# EAGLE schematic sweet sixteen v24_3 (EAGLE 7.2.0)

## Sheet 1 of 3: Faders / Jacks / Digital
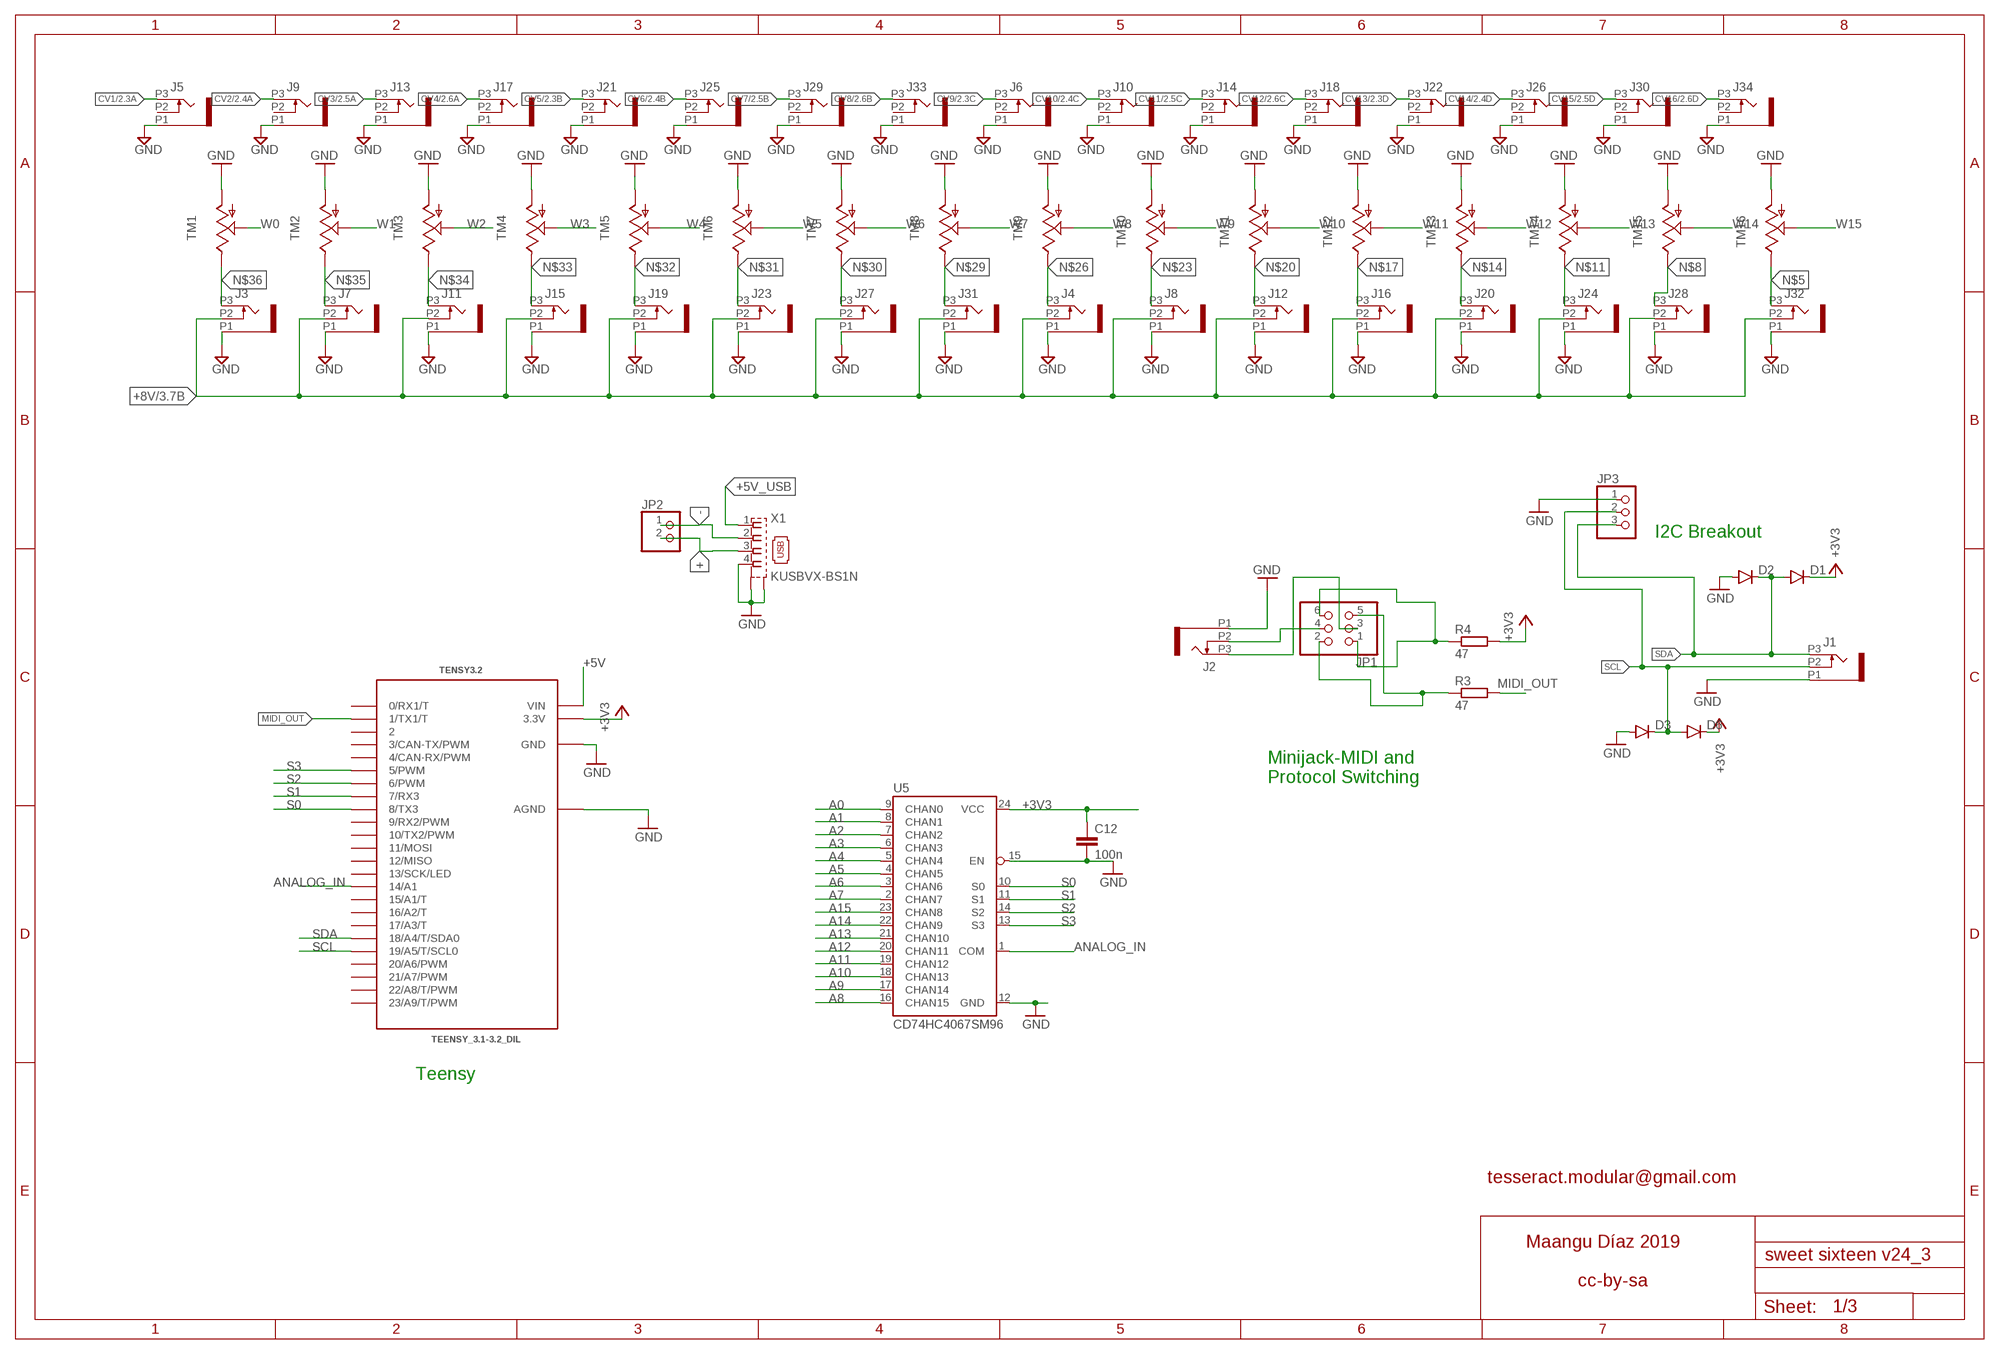
[diagram p0: schematic, sheet 1]

### Parts
C12  100n  C-EUC0603  [C0603]
D1  DIODESOD123  [SOD-123]
D2  DIODESOD123  [SOD-123]
D3  DIODESOD123  [SOD-123]
D6  DIODESOD123  [SOD-123]
J1  PJ301_THONKICONN6  [WQP_PJ_301M6]
J2  PJ301_THONKICONN6  [WQP_PJ_301M6]
J3  PJ301_THONKICONN6  [WQP_PJ_301M6]
J4  PJ301_THONKICONN6  [WQP_PJ_301M6]
J5  PJ301_THONKICONN6  [WQP_PJ_301M6]
J6  PJ301_THONKICONN6  [WQP_PJ_301M6]
J7  PJ301_THONKICONN6  [WQP_PJ_301M6]
J8  PJ301_THONKICONN6  [WQP_PJ_301M6]
J9  PJ301_THONKICONN6  [WQP_PJ_301M6]
J10  PJ301_THONKICONN6  [WQP_PJ_301M6]
J11  PJ301_THONKICONN6  [WQP_PJ_301M6]
J12  PJ301_THONKICONN6  [WQP_PJ_301M6]
J13  PJ301_THONKICONN6  [WQP_PJ_301M6]
J14  PJ301_THONKICONN6  [WQP_PJ_301M6]
J15  PJ301_THONKICONN6  [WQP_PJ_301M6]
J16  PJ301_THONKICONN6  [WQP_PJ_301M6]
J17  PJ301_THONKICONN6  [WQP_PJ_301M6]
J18  PJ301_THONKICONN6  [WQP_PJ_301M6]
J19  PJ301_THONKICONN6  [WQP_PJ_301M6]
J20  PJ301_THONKICONN6  [WQP_PJ_301M6]
J21  PJ301_THONKICONN6  [WQP_PJ_301M6]
J22  PJ301_THONKICONN6  [WQP_PJ_301M6]
J23  PJ301_THONKICONN6  [WQP_PJ_301M6]
J24  PJ301_THONKICONN6  [WQP_PJ_301M6]
J25  PJ301_THONKICONN6  [WQP_PJ_301M6]
J26  PJ301_THONKICONN6  [WQP_PJ_301M6]
J27  PJ301_THONKICONN6  [WQP_PJ_301M6]
J28  PJ301_THONKICONN6  [WQP_PJ_301M6]
J29  PJ301_THONKICONN6  [WQP_PJ_301M6]
J30  PJ301_THONKICONN6  [WQP_PJ_301M6]
J31  PJ301_THONKICONN6  [WQP_PJ_301M6]
J32  PJ301_THONKICONN6  [WQP_PJ_301M6]
J33  PJ301_THONKICONN6  [WQP_PJ_301M6]
J34  PJ301_THONKICONN6  [WQP_PJ_301M6]
JP1  PINHD-2X3  [2X03]
JP2  PINHD-1X2  [1X02]
JP3  PINHD-1X3  [1X03]
R3  47  R-EU_R0805  [R0805]
R4  47  R-EU_R0805  [R0805]
TENSY3.2  TEENSY_3.1-3.2_DIL  [TEENSY_3.0-3.2&LC_DIL]
TM1  TRIMSLIDE45  [SLIDEPOT-45]
TM2  TRIMSLIDE45  [SLIDEPOT-45]
TM3  TRIMSLIDE45  [SLIDEPOT-45]
TM4  TRIMSLIDE45  [SLIDEPOT-45]
TM5  TRIMSLIDE45  [SLIDEPOT-45]
TM6  TRIMSLIDE45  [SLIDEPOT-45]
TM7  TRIMSLIDE45  [SLIDEPOT-45]
TM8  TRIMSLIDE45  [SLIDEPOT-45]
TM9  TRIMSLIDE45  [SLIDEPOT-45]
TM10  TRIMSLIDE45  [SLIDEPOT-45]
TM11  TRIMSLIDE45  [SLIDEPOT-45]
TM12  TRIMSLIDE45  [SLIDEPOT-45]
TM13  TRIMSLIDE45  [SLIDEPOT-45]
TM14  TRIMSLIDE45  [SLIDEPOT-45]
TM15  TRIMSLIDE45  [SLIDEPOT-45]
TM16  TRIMSLIDE45  [SLIDEPOT-45]
U5  CD74HC4067SM96  744067SO24  [SOIC127P1030X265-24]
X1  KUSBVX-BS1N  [KUSBVX-BS1N]

### Nets
+: JP2.2 X1.3
+3V3: C12.1 D1.C D6.C R4.2 TENSY3.2.3.3V U5.24(VCC) ; also sheet 2
+5V: TENSY3.2.VIN ; also sheet 3
+5V_USB: X1.1
+8V: J3.P2 J4.P2 J7.P2 J8.P2 J11.P2 J12.P2 J15.P2 J16.P2 J19.P2 J20.P2 J23.P2 J24.P2 J27.P2 J28.P2 J31.P2 J32.P2 ; also sheet 3
-: JP2.1 X1.2
A0: U5.9(CHAN0) ; also sheet 2
A1: U5.8(CHAN1) ; also sheet 2
A2: U5.7(CHAN2) ; also sheet 2
A3: U5.6(CHAN3) ; also sheet 2
A4: U5.5(CHAN4) ; also sheet 2
A5: U5.4(CHAN5) ; also sheet 2
A6: U5.3(CHAN6) ; also sheet 2
A7: U5.2(CHAN7) ; also sheet 2
A8: U5.16(CHAN15) ; also sheet 2
A9: U5.17(CHAN14) ; also sheet 2
A10: U5.18(CHAN13) ; also sheet 2
A11: U5.19(CHAN12) ; also sheet 2
A12: U5.20(CHAN11) ; also sheet 2
A13: U5.21(CHAN10) ; also sheet 2
A14: U5.22(CHAN9) ; also sheet 2
A15: U5.23(CHAN8) ; also sheet 2
ANALOG_IN: TENSY3.2.14/A0(14/A1) U5.1(COM)
CV1: J5.P3 ; also sheet 2
CV2: J9.P3 ; also sheet 2
CV3: J13.P3 ; also sheet 2
CV4: J17.P3 ; also sheet 2
CV5: J21.P3 ; also sheet 2
CV6: J25.P3 ; also sheet 2
CV7: J29.P3 ; also sheet 2
CV8: J33.P3 ; also sheet 2
CV9: J6.P3 ; also sheet 2
CV10: J10.P3 ; also sheet 2
CV11: J14.P3 ; also sheet 2
CV12: J18.P3 ; also sheet 2
CV13: J22.P3 ; also sheet 2
CV14: J26.P3 ; also sheet 2
CV15: J30.P3 ; also sheet 2
CV16: J34.P3 ; also sheet 2
GND: C12.2 D2.A D3.A J1.P1 J2.P1 J3.P1 J4.P1 J5.P1 J6.P1 J7.P1 J8.P1 J9.P1 J10.P1 J11.P1 J12.P1 J13.P1 J14.P1 J15.P1 J16.P1 J17.P1 J18.P1 J19.P1 J20.P1 J21.P1 J22.P1 J23.P1 J24.P1 J25.P1 J26.P1 J27.P1 J28.P1 J29.P1 J30.P1 J31.P1 J32.P1 J33.P1 J34.P1 JP3.1 TENSY3.2.AGND TENSY3.2.GND TM1.A TM2.A TM3.A TM4.A TM5.A TM6.A TM7.A TM8.A TM9.A TM10.A TM11.A TM12.A TM13.A TM14.A TM15.A TM16.A U5.12(GND) U5.15(EN) X1.4 X1.M1(S1) X1.M2(S2) ; also sheet 2,3
MIDI_OUT: R3.2 TENSY3.2.1(1/TX1/T)
N$1: J2.P3 JP1.3
N$2: J2.P2 JP1.4
N$3: JP1.2 JP1.5 R3.1
N$4: JP1.1 JP1.6 R4.1
N$5: J32.P3 TM16.B
N$8: J28.P3 TM15.B
N$11: J24.P3 TM14.B
N$14: J20.P3 TM13.B
N$17: J16.P3 TM12.B
N$20: J12.P3 TM11.B
N$23: J8.P3 TM10.B
N$26: J4.P3 TM9.B
N$29: J31.P3 TM8.B
N$30: J27.P3 TM7.B
N$31: J23.P3 TM6.B
N$32: J19.P3 TM5.B
N$33: J15.P3 TM4.B
N$34: J11.P3 TM3.B
N$35: J7.P3 TM2.B
N$36: J3.P3 TM1.B
S0: TENSY3.2.8(8/TX3) U5.10(S0)
S1: TENSY3.2.7(7/RX3) U5.11(S1)
S2: TENSY3.2.6(6/PWM) U5.14(S2)
S3: TENSY3.2.5(5/PWM) U5.13(S3)
SCL: D3.C D6.A J1.P2 JP3.2 TENSY3.2.19/A5(19/A5/T/SCL0)
SDA: D1.A D2.C J1.P3 JP3.3 TENSY3.2.18/A4(18/A4/T/SDA0)
W0: TM1.WIPER ; also sheet 2
W1: TM2.WIPER ; also sheet 2
W2: TM3.WIPER ; also sheet 2
W3: TM4.WIPER ; also sheet 2
W4: TM5.WIPER ; also sheet 2
W5: TM6.WIPER ; also sheet 2
W6: TM7.WIPER ; also sheet 2
W7: TM8.WIPER ; also sheet 2
W8: TM9.WIPER ; also sheet 2
W9: TM10.WIPER ; also sheet 2
W10: TM11.WIPER ; also sheet 2
W11: TM12.WIPER ; also sheet 2
W12: TM13.WIPER ; also sheet 2
W13: TM14.WIPER ; also sheet 2
W14: TM15.WIPER ; also sheet 2
W15: TM16.WIPER ; also sheet 2
Unconnected: J5.P2 J6.P2 J9.P2 J10.P2 J13.P2 J14.P2 J17.P2 J18.P2 J21.P2 J22.P2 J25.P2 J26.P2 J29.P2 J30.P2 J33.P2 J34.P2 TENSY3.2.0(0/RX1/T) TENSY3.2.2 TENSY3.2.3(3/CAN-TX/PWM) TENSY3.2.4(4/CAN-RX/PWM) TENSY3.2.9(9/RX2/PWM) TENSY3.2.10(10/TX2/PWM) TENSY3.2.11(11/MOSI) TENSY3.2.12(12/MISO) TENSY3.2.13(13/SCK/LED) TENSY3.2.15/A1(15/A1/T) TENSY3.2.16/A2(16/A2/T) TENSY3.2.17/A3(17/A3/T) TENSY3.2.20/A6(20/A6/PWM) TENSY3.2.21/A7(21/A7/PWM) TENSY3.2.22/A8(22/A8/T/PWM) TENSY3.2.23/A9(23/A9/T/PWM)

### Notes on the sheet
- I2C Breakout
- Minijack-MIDI and 
  Protocol Switching
- Teensy
- tesseract.modular@gmail.com
- Maangu Díaz 2019
- cc-by-sa

## Sheet 2 of 3: Buffers / OpAmp power
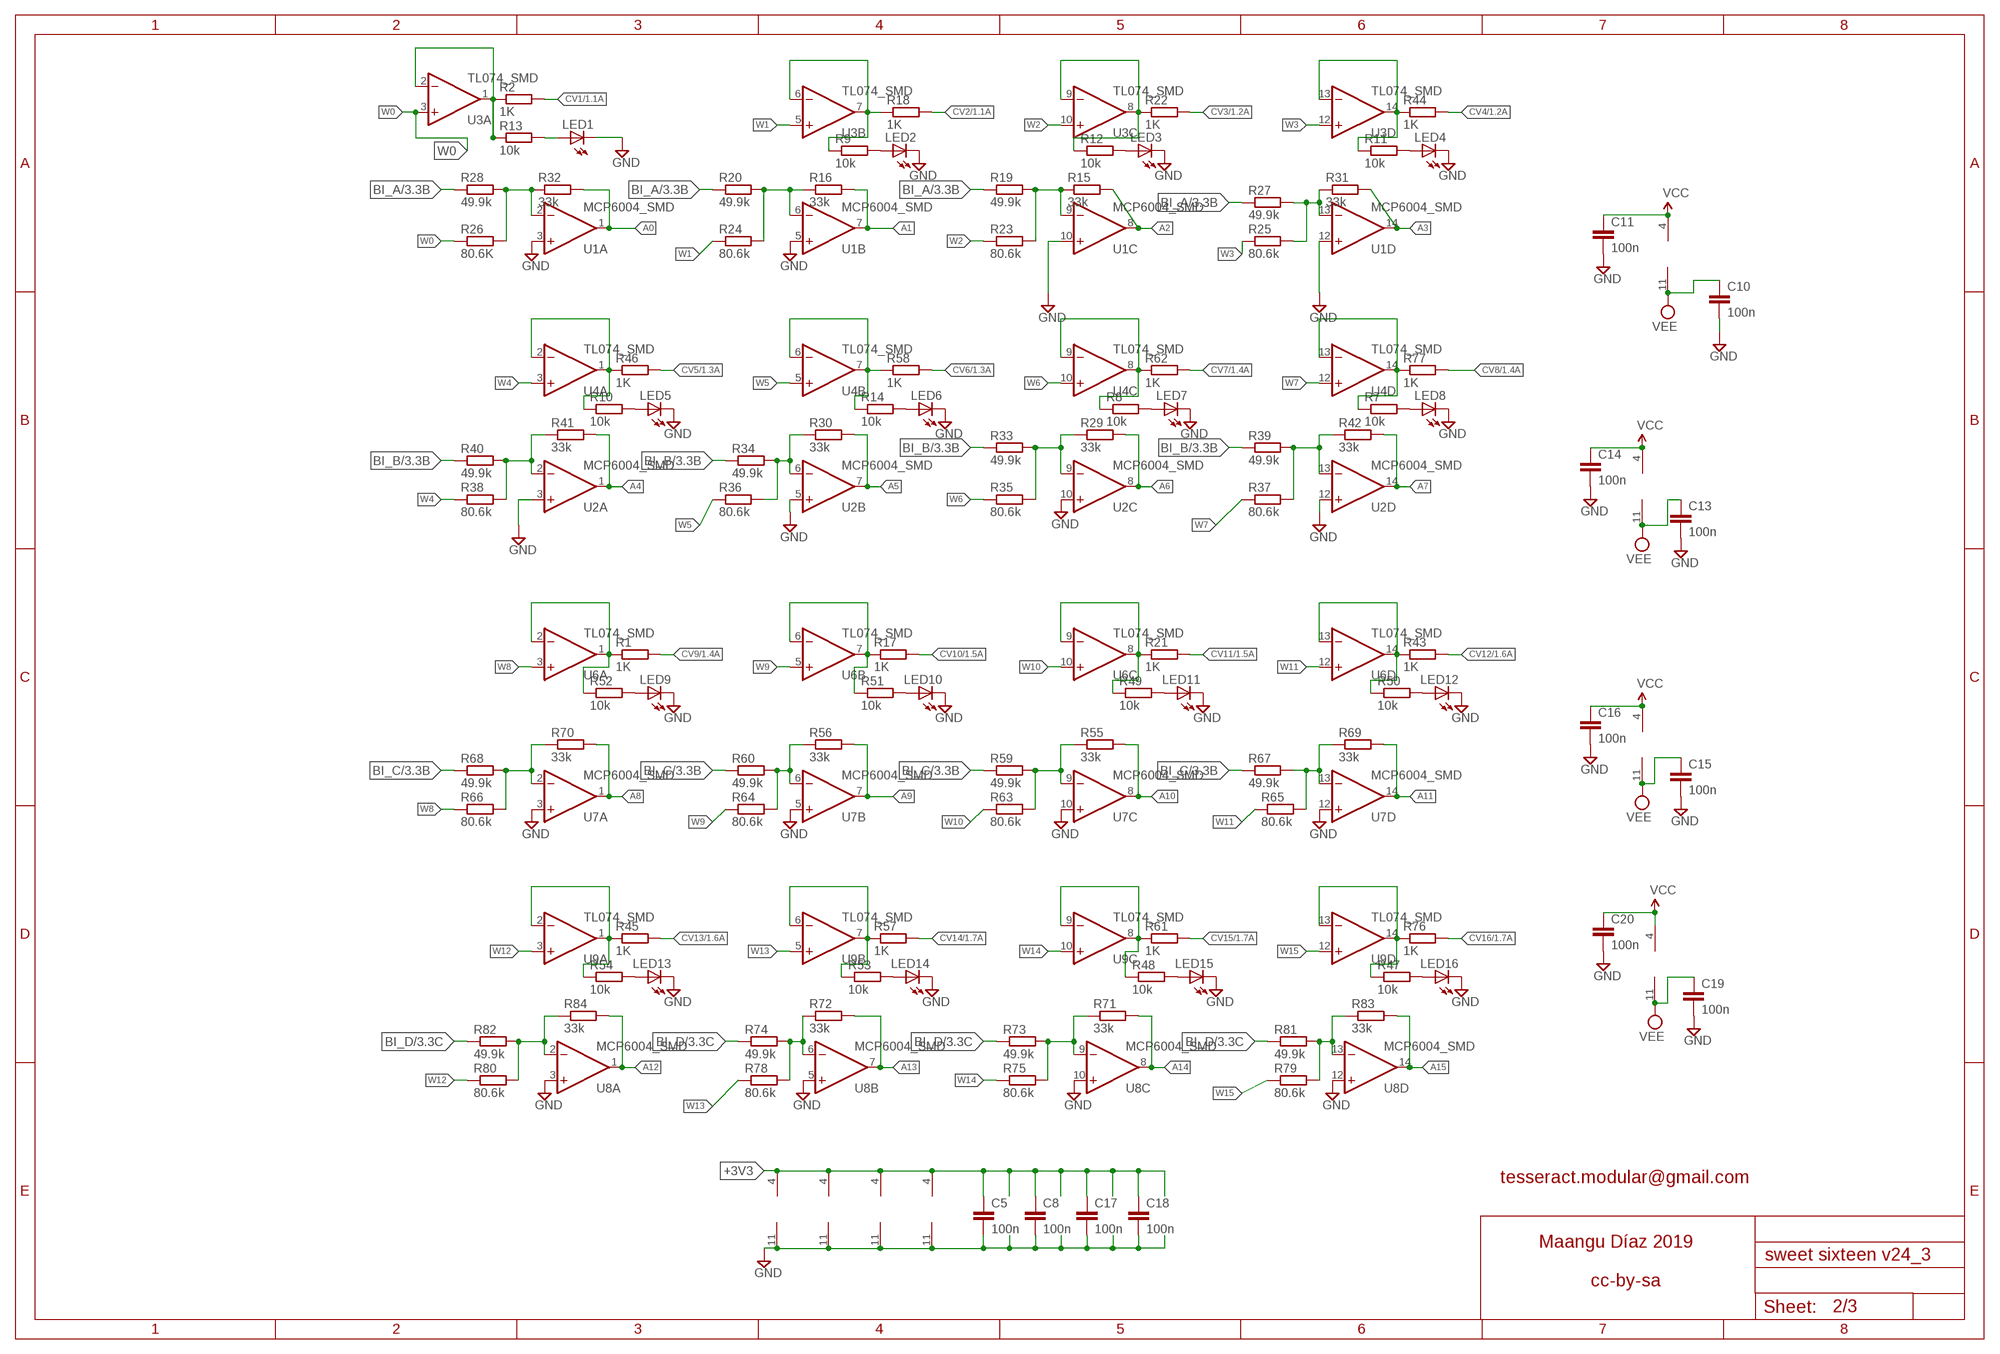
[diagram p1: schematic, sheet 2]

### Parts
C5  100n  C-EUC0603  [C0603]
C8  100n  C-EUC0603K  [C0603K]
C10  100n  C-EUC0603  [C0603]
C11  100n  C-EUC0603  [C0603]
C13  100n  C-EUC0603  [C0603]
C14  100n  C-EUC0603  [C0603]
C15  100n  C-EUC0603  [C0603]
C16  100n  C-EUC0603  [C0603]
C17  100n  C-EUC0603K  [C0603K]
C18  100n  C-EUC0603  [C0603]
C19  100n  C-EUC0603  [C0603]
C20  100n  C-EUC0603  [C0603]
LED1  LED3MM  [LED3MM]
LED2  LED3MM  [LED3MM]
LED3  LED3MM  [LED3MM]
LED4  LED3MM  [LED3MM]
LED5  LED3MM  [LED3MM]
LED6  LED3MM  [LED3MM]
LED7  LED3MM  [LED3MM]
LED8  LED3MM  [LED3MM]
LED9  LED3MM  [LED3MM]
LED10  LED3MM  [LED3MM]
LED11  LED3MM  [LED3MM]
LED12  LED3MM  [LED3MM]
LED13  LED3MM  [LED3MM]
LED14  LED3MM  [LED3MM]
LED15  LED3MM  [LED3MM]
LED16  LED3MM  [LED3MM]
R1  1K  R-EU_R0603  [R0603]
R2  1K  R-EU_R0603  [R0603]
R7  10k  R-EU_R0603  [R0603]
R8  10k  R-EU_R0603  [R0603]
R9  10k  R-EU_R0603  [R0603]
R10  10k  R-EU_R0603  [R0603]
R11  10k  R-EU_R0603  [R0603]
R12  10k  R-EU_R0603  [R0603]
R13  10k  R-EU_R0603  [R0603]
R14  10k  R-EU_R0603  [R0603]
R15  33k  R-EU_R0603  [R0603]
R16  33k  R-EU_R0603  [R0603]
R17  1K  R-EU_R0603  [R0603]
R18  1K  R-EU_R0603  [R0603]
R19  49.9k  R-EU_R0603  [R0603]
R20  49.9k  R-EU_R0603  [R0603]
R21  1K  R-EU_R0603  [R0603]
R22  1K  R-EU_R0603  [R0603]
R23  80.6k  R-EU_R0603  [R0603]
R24  80.6k  R-EU_R0603  [R0603]
R25  80.6k  R-EU_R0603  [R0603]
R26  80.6K  R-EU_R0603  [R0603]
R27  49.9k  R-EU_R0603  [R0603]
R28  49.9k  R-EU_R0603  [R0603]
R29  33k  R-EU_R0603  [R0603]
R30  33k  R-EU_R0603  [R0603]
R31  33k  R-EU_R0603  [R0603]
R32  33k  R-EU_R0603  [R0603]
R33  49.9k  R-EU_R0603  [R0603]
R34  49.9k  R-EU_R0603  [R0603]
R35  80.6k  R-EU_R0603  [R0603]
R36  80.6k  R-EU_R0603  [R0603]
R37  80.6k  R-EU_R0603  [R0603]
R38  80.6k  R-EU_R0603  [R0603]
R39  49.9k  R-EU_R0603  [R0603]
R40  49.9k  R-EU_R0603  [R0603]
R41  33k  R-EU_R0603  [R0603]
R42  33k  R-EU_R0603  [R0603]
R43  1K  R-EU_R0603  [R0603]
R44  1K  R-EU_R0603  [R0603]
R45  1K  R-EU_R0603  [R0603]
R46  1K  R-EU_R0603  [R0603]
R47  10k  R-EU_R0603  [R0603]
R48  10k  R-EU_R0603  [R0603]
R49  10k  R-EU_R0603  [R0603]
R50  10k  R-EU_R0603  [R0603]
R51  10k  R-EU_R0603  [R0603]
R52  10k  R-EU_R0603  [R0603]
R53  10k  R-EU_R0603  [R0603]
R54  10k  R-EU_R0603  [R0603]
R55  33k  R-EU_R0603  [R0603]
R56  33k  R-EU_R0603  [R0603]
R57  1K  R-EU_R0603  [R0603]
R58  1K  R-EU_R0603  [R0603]
R59  49.9k  R-EU_R0603  [R0603]
R60  49.9k  R-EU_R0603  [R0603]
R61  1K  R-EU_R0603  [R0603]
R62  1K  R-EU_R0603  [R0603]
R63  80.6k  R-EU_R0603  [R0603]
R64  80.6k  R-EU_R0603  [R0603]
R65  80.6k  R-EU_R0603  [R0603]
R66  80.6k  R-EU_R0603  [R0603]
R67  49.9k  R-EU_R0603  [R0603]
R68  49.9k  R-EU_R0603  [R0603]
R69  33k  R-EU_R0603  [R0603]
R70  33k  R-EU_R0603  [R0603]
R71  33k  R-EU_R0603  [R0603]
R72  33k  R-EU_R0603  [R0603]
R73  49.9k  R-EU_R0603  [R0603]
R74  49.9k  R-EU_R0603  [R0603]
R75  80.6k  R-EU_R0603  [R0603]
R76  1K  R-EU_R0603  [R0603]
R77  1K  R-EU_R0603  [R0603]
R78  80.6k  R-EU_R0603  [R0603]
R79  80.6k  R-EU_R0603  [R0603]
R80  80.6k  R-EU_R0603  [R0603]
R81  49.9k  R-EU_R0603  [R0603]
R82  49.9k  R-EU_R0603  [R0603]
R83  33k  R-EU_R0603  [R0603]
R84  33k  R-EU_R0603  [R0603]
U1  MCP6004_SMD  [SO14]
U2  MCP6004_SMD  [SO14]
U3  TL074_SMD  [SO14]
U4  TL074_SMD  [SO14]
U6  TL074_SMD  [SO14]
U7  MCP6004_SMD  [SO14]
U8  MCP6004_SMD  [SO14]
U9  TL074_SMD  [SO14]

### Nets
+3V3: C5.1 C8.1 C17.1 C18.1 U1.4(P:V+) U2.4(P:V+) U7.4(P:V+) U8.4(P:V+) ; also sheet 1
A0: R32.2 U1.1(A:OUT) ; also sheet 1
A1: R16.2 U1.7(B:OUT) ; also sheet 1
A2: R15.2 U1.8(C:OUT) ; also sheet 1
A3: R31.2 U1.14(D:OUT) ; also sheet 1
A4: R41.2 U2.1(A:OUT) ; also sheet 1
A5: R30.2 U2.7(B:OUT) ; also sheet 1
A6: R29.2 U2.8(C:OUT) ; also sheet 1
A7: R42.2 U2.14(D:OUT) ; also sheet 1
A8: R70.2 U7.1(A:OUT) ; also sheet 1
A9: R56.2 U7.7(B:OUT) ; also sheet 1
A10: R55.2 U7.8(C:OUT) ; also sheet 1
A11: R69.2 U7.14(D:OUT) ; also sheet 1
A12: R84.2 U8.1(A:OUT) ; also sheet 1
A13: R72.2 U8.7(B:OUT) ; also sheet 1
A14: R71.2 U8.8(C:OUT) ; also sheet 1
A15: R83.2 U8.14(D:OUT) ; also sheet 1
BI_A: R19.1 R20.1 R27.1 R28.1 ; also sheet 3
BI_B: R33.1 R34.1 R39.1 R40.1 ; also sheet 3
BI_C: R59.1 R60.1 R67.1 R68.1 ; also sheet 3
BI_D: R73.1 R74.1 R81.1 R82.1 ; also sheet 3
CV1: R2.2 ; also sheet 1
CV2: R18.2 ; also sheet 1
CV3: R22.2 ; also sheet 1
CV4: R44.2 ; also sheet 1
CV5: R46.2 ; also sheet 1
CV6: R58.2 ; also sheet 1
CV7: R62.2 ; also sheet 1
CV8: R77.2 ; also sheet 1
CV9: R1.2 ; also sheet 1
CV10: R17.2 ; also sheet 1
CV11: R21.2 ; also sheet 1
CV12: R43.2 ; also sheet 1
CV13: R45.2 ; also sheet 1
CV14: R57.2 ; also sheet 1
CV15: R61.2 ; also sheet 1
CV16: R76.2 ; also sheet 1
GND: C5.2 C8.2 C10.2 C11.2 C13.2 C14.2 C15.2 C16.2 C17.2 C18.2 C19.2 C20.2 LED1.K(C) LED2.K(C) LED3.K(C) LED4.K(C) LED5.K(C) LED6.K(C) LED7.K(C) LED8.K(C) LED9.K(C) LED10.K(C) LED11.K(C) LED12.K(C) LED13.K(C) LED14.K(C) LED15.K(C) LED16.K(C) U1.3(A:+IN) U1.5(B:+IN) U1.10(C:+IN) U1.11(P:V-) U1.12(D:+IN) U2.3(A:+IN) U2.5(B:+IN) U2.10(C:+IN) U2.11(P:V-) U2.12(D:+IN) U7.3(A:+IN) U7.5(B:+IN) U7.10(C:+IN) U7.11(P:V-) U7.12(D:+IN) U8.3(A:+IN) U8.5(B:+IN) U8.10(C:+IN) U8.11(P:V-) U8.12(D:+IN) ; also sheet 1,3
N$6: R15.1 R19.2 R23.2 U1.9(C:-IN)
N$7: R25.2 R27.2 R31.1 U1.13(D:-IN)
N$9: R26.2 R28.2 R32.1 U1.2(A:-IN)
N$10: R16.1 R20.2 R24.2 U1.6(B:-IN)
N$12: R38.2 R40.2 R41.1 U2.2(A:-IN)
N$13: R30.1 R34.2 R36.2 U2.6(B:-IN)
N$15: R29.1 R33.2 R35.2 U2.9(C:-IN)
N$16: R37.2 R39.2 R42.1 U2.13(D:-IN)
N$18: R80.2 R82.2 R84.1 U8.2(A:-IN)
N$19: LED1.A R13.2
N$21: R71.1 R73.2 R75.2 U8.9(C:-IN)
N$22: R79.2 R81.2 R83.1 U8.13(D:-IN)
N$24: R66.2 R68.2 R70.1 U7.2(A:-IN)
N$25: LED2.A R9.2
N$27: R56.1 R60.2 R64.2 U7.6(B:-IN)
N$28: R55.1 R59.2 R63.2 U7.9(C:-IN)
N$37: R65.2 R67.2 R69.1 U7.13(D:-IN)
N$38: LED3.A R12.2
N$39: LED4.A R11.2
N$40: LED8.A R7.2
N$42: LED7.A R8.2
N$43: LED6.A R14.2
N$44: LED5.A R10.2
N$45: LED9.A R52.2
N$46: LED10.A R51.2
N$47: LED11.A R49.2
N$48: LED12.A R50.2
N$49: LED13.A R54.2
N$50: LED14.A R53.2
N$51: LED15.A R48.2
N$52: R72.1 R74.2 R78.2 U8.6(B:-IN)
N$53: LED16.A R47.2
N$300: R2.1 R13.1 U3.1(A:OUT) U3.2(A:-IN)
N$301: R9.1 R18.1 U3.6(B:-IN) U3.7(B:OUT)
N$302: R12.1 R22.1 U3.8(C:OUT) U3.9(C:-IN)
N$303: R11.1 R44.1 U3.13(D:-IN) U3.14(D:OUT)
N$304: R10.1 R46.1 U4.1(A:OUT) U4.2(A:-IN)
N$305: R14.1 R58.1 U4.6(B:-IN) U4.7(B:OUT)
N$306: R8.1 R62.1 U4.8(C:OUT) U4.9(C:-IN)
N$307: R7.1 R77.1 U4.13(D:-IN) U4.14(D:OUT)
N$308: R1.1 R52.1 U6.1(A:OUT) U6.2(A:-IN)
N$309: R17.1 R51.1 U6.6(B:-IN) U6.7(B:OUT)
N$310: R21.1 R49.1 U6.8(C:OUT) U6.9(C:-IN)
N$311: R43.1 R50.1 U6.13(D:-IN) U6.14(D:OUT)
N$312: R45.1 R54.1 U9.1(A:OUT) U9.2(A:-IN)
N$313: R53.1 R57.1 U9.6(B:-IN) U9.7(B:OUT)
N$314: R48.1 R61.1 U9.8(C:OUT) U9.9(C:-IN)
N$315: R47.1 R76.1 U9.13(D:-IN) U9.14(D:OUT)
VCC: C11.1 C14.1 C16.1 C20.1 U3.4(P:V+) U4.4(P:V+) U6.4(P:V+) U9.4(P:V+) ; also sheet 3
VEE: C10.1 C13.1 C15.1 C19.1 U3.11(P:V-) U4.11(P:V-) U6.11(P:V-) U9.11(P:V-) ; also sheet 3
W0: R26.1 U3.3(A:+IN) ; also sheet 1
W1: R24.1 U3.5(B:+IN) ; also sheet 1
W2: R23.1 U3.10(C:+IN) ; also sheet 1
W3: R25.1 U3.12(D:+IN) ; also sheet 1
W4: R38.1 U4.3(A:+IN) ; also sheet 1
W5: R36.1 U4.5(B:+IN) ; also sheet 1
W6: R35.1 U4.10(C:+IN) ; also sheet 1
W7: R37.1 U4.12(D:+IN) ; also sheet 1
W8: R66.1 U6.3(A:+IN) ; also sheet 1
W9: R64.1 U6.5(B:+IN) ; also sheet 1
W10: R63.1 U6.10(C:+IN) ; also sheet 1
W11: R65.1 U6.12(D:+IN) ; also sheet 1
W12: R80.1 U9.3(A:+IN) ; also sheet 1
W13: R78.1 U9.5(B:+IN) ; also sheet 1
W14: R75.1 U9.10(C:+IN) ; also sheet 1
W15: R79.1 U9.12(D:+IN) ; also sheet 1

### Notes on the sheet
- tesseract.modular@gmail.com
- Maangu Díaz 2019
- cc-by-sa

## Sheet 3 of 3
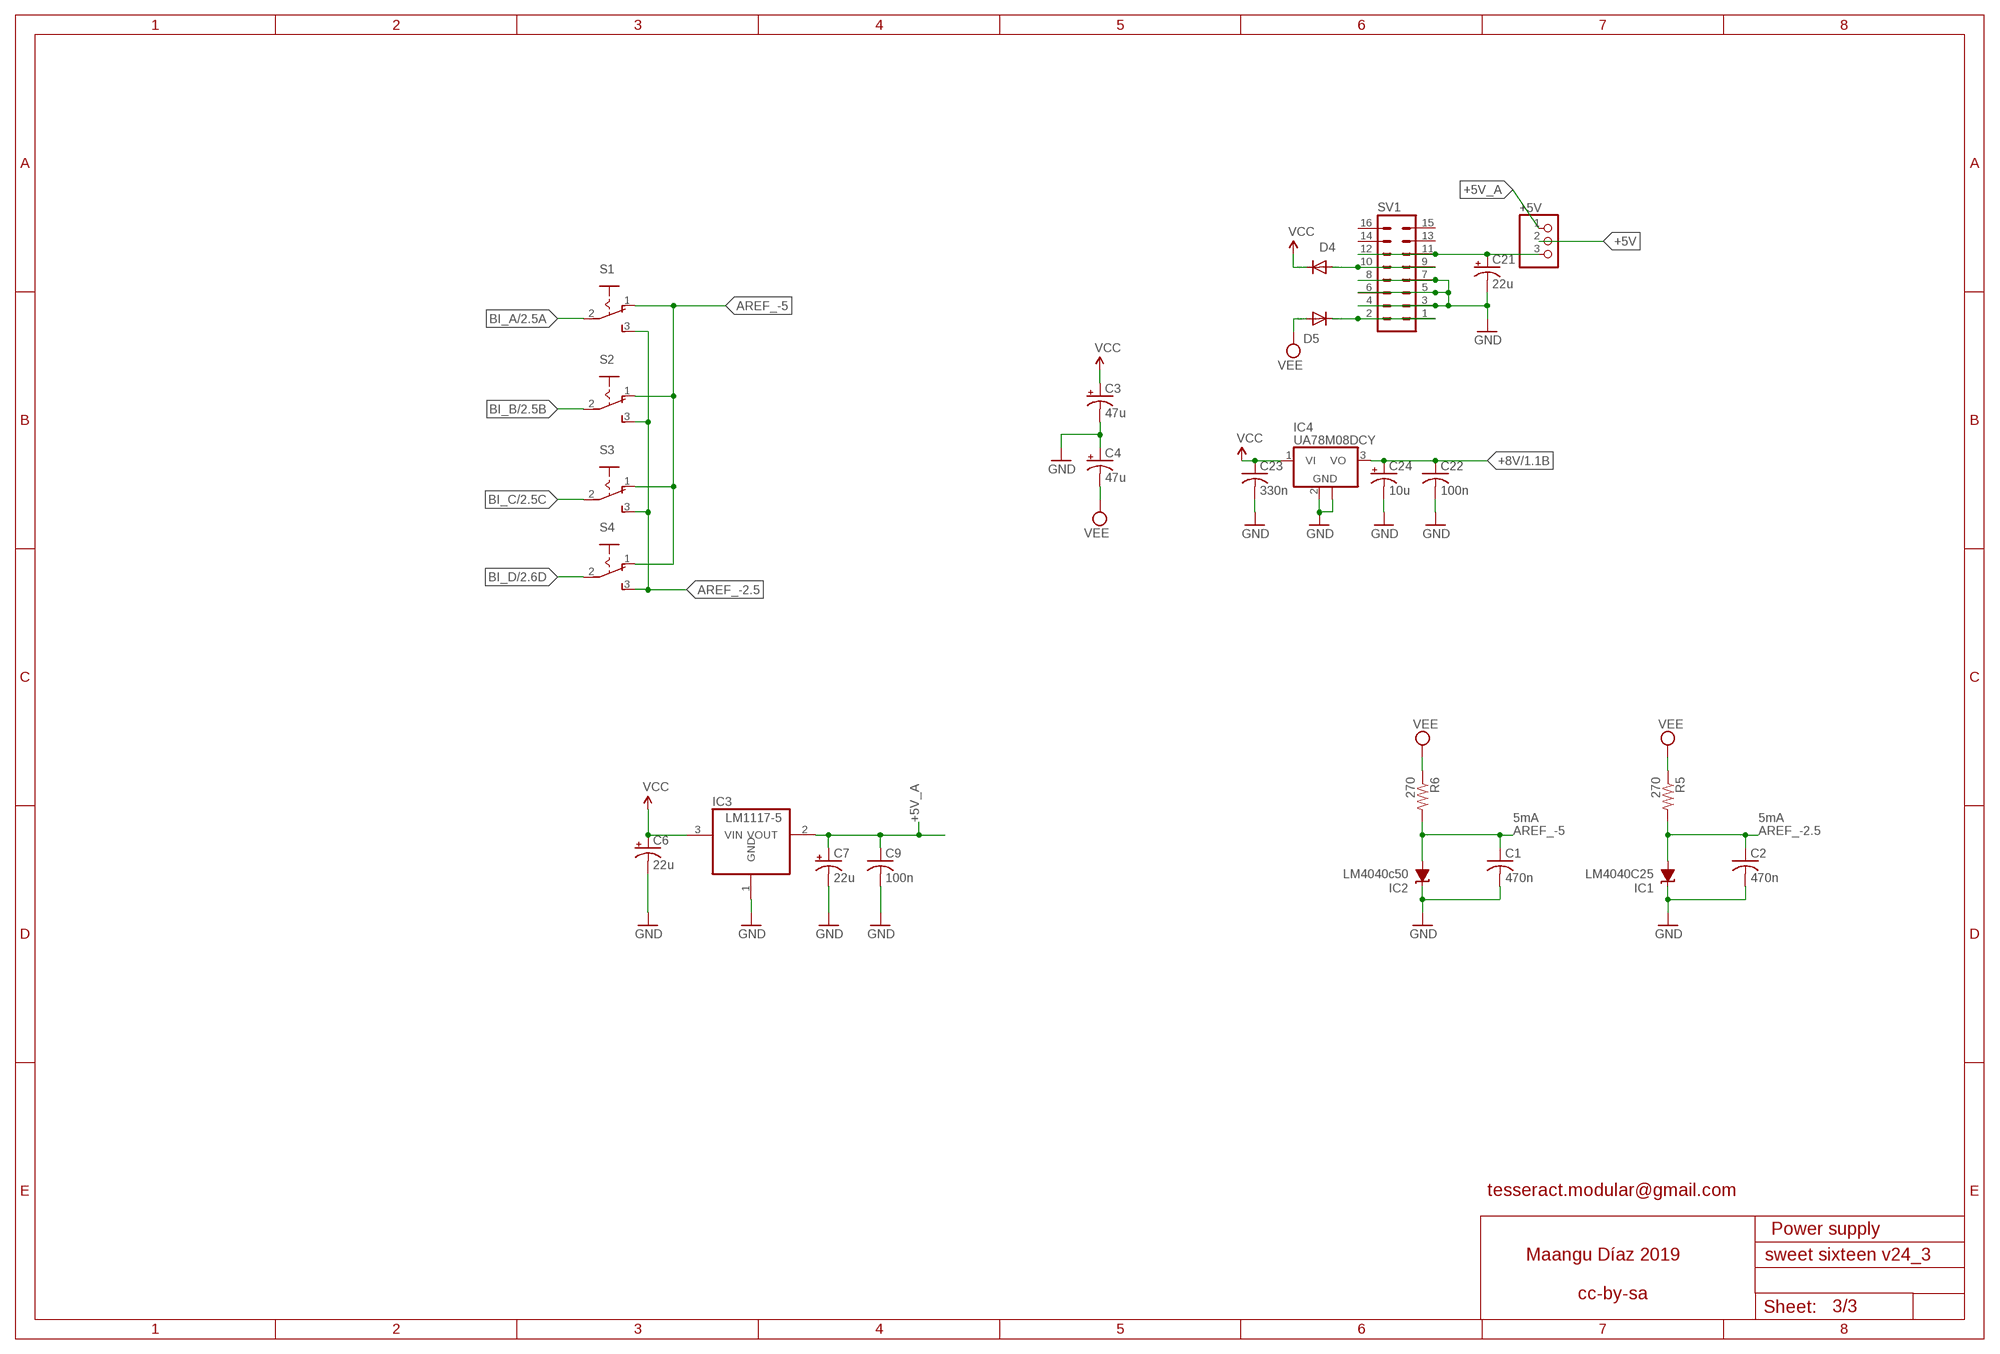
[diagram p2: schematic, sheet 3]

### Parts
+5V  PINHD-1X3  [1X03]
C1  470n  C-USC0603  [C0603]
C2  470n  C-USC0603  [C0603]
C3  47u  CPOL-USD  [PANASONIC_D]
C4  47u  CPOL-USD  [PANASONIC_D]
C6  22u  CPOL-USD  [PANASONIC_D]
C7  22u  CPOL-USD  [PANASONIC_D]
C9  100n  C-USC0603  [C0603]
C21  22u  CPOL-USD  [PANASONIC_D]
C22  100n  C-USC0603  [C0603]
C23  330n  C-USC0603  [C0603]
C24  10u  CPOL-USC  [PANASONIC_C]
D4  1N5819HW  DIODE-SOD123  [SOD123]
D5  1N5819HW  DIODE-SOD123  [SOD123]
IC1  LM4040C25  LM4041B12DBZ  [DBZ_R-PDSO-G3]
IC2  LM4040c50  LM4041B12DBZ  [DBZ_R-PDSO-G3]
IC3  LM1117-5  REG1117  [SOT223]
IC4  UA78M08DCY  [SOT223]
R5  270  R-US_R0603  [R0603]
R6  270  R-US_R0603  [R0603]
S1  255SB-MANGURRIN  [255SB_MANGU]
S2  255SB-MANGURRIN  [255SB_MANGU]
S3  255SB-MANGURRIN  [255SB_MANGU]
S4  255SB-MANGURRIN  [255SB_MANGU]
SV1  ML16  [ML16]

### Nets
+5V: +5V.2 ; also sheet 1
+5V_A: +5V.1 C7.+ C9.1 IC3.2(VOUT)
+8V: C22.1 C24.+ IC4.3(VO) ; also sheet 1
AREF_-2.5: C2.1 IC1.2(A) R5.2 S1.3(S) S2.3(S) S3.3(S) S4.3(S)
AREF_-5: C1.1 IC2.2(A) R6.2 S1.1(O) S2.1(O) S3.1(O) S4.1(O)
BI_A: S1.2(P) ; also sheet 2
BI_B: S2.2(P) ; also sheet 2
BI_C: S3.2(P) ; also sheet 2
BI_D: S4.2(P) ; also sheet 2
GND: C1.2 C2.2 C3.- C4.+ C6.- C7.- C9.2 C21.- C22.2 C23.2 C24.- IC1.1(C) IC2.1(C) IC3.1(GND) IC4.2(GND) IC4.4(GND) SV1.3 SV1.4 SV1.5 SV1.6 SV1.7 SV1.8 ; also sheet 1,2
N$41: +5V.3 C21.+ SV1.11 SV1.12
N$56: D4.A SV1.9 SV1.10
N$64: D5.C SV1.1 SV1.2
VCC: C3.+ C6.+ C23.1 D4.C IC3.3(VIN) IC4.1(VI) ; also sheet 2
VEE: C4.- D5.A R5.1 R6.1 ; also sheet 2
Unconnected: SV1.13 SV1.14 SV1.15 SV1.16

### Notes on the sheet
- 5mA | 5mA
- tesseract.modular@gmail.com
- Power supply
- Maangu Díaz 2019
- cc-by-sa

## Library data of the parts
+5V JP3 = MANGU-pinhead:PINHD-1X3: PIN HEADER
C1 C2 C9 C22 C23 = rcl:C-US: CAPACITOR, American symbol
C3 C4 C6 C7 C21 C24 = rcl:CPOL-US: POLARIZED CAPACITOR, American symbol
C5 C8 C10-C20 = rcl:C-EU: CAPACITOR, European symbol
D1-D3 D6 = foxfield:DIODE
D4 D5 = diode:DIODE-: DIODE
IC1 IC2 = texas:LM4041: PRECISION MICROPOWER SHUNT VOLTAGE REFERENCE Source: http://focus.ti.com/lit/ds/slcs146e/slcs146e.pdf; MPN: LM4041B12IDBZR; OC_FARNELL: 1575212; OC_NEWARK: 58K5882
IC3 = og-vreg:REG1117: 800mA and 1A Low Dropout (LDO) Positive Regulator 1.8V, 2.5V, 2.85V, 3.3V, 5V, and Adj
IC4 = linear:UA78M*: POSITIVE-VOLTAGE REGULATORS Source: http://focus.ti.com/lit/ds/symlink/ua78m33.pdf
J1-J34 = og-pj301:PJ301_THONKICONN
JP1 = MANGU-pinhead:PINHD-2X3: PIN HEADER
JP2 = MANGU-pinhead:PINHD-1X2: PIN HEADER
LED1-LED16 = TomW:LED: LED OSRAM: - CHIPLED LG R971, LG N971, LY N971, LG Q971, LY Q971, LO R971, LY R971 LH N974, LH R974 LS Q976, LO Q976, LY Q976 LO Q996 - Hyper CHIPLED LW Q18S LB Q993, LB Q99A, LB R99A - SideLED LS A670, LO A670, LY A670, LG A670, LP A670 LB A673, LV A673, LT A673, LW A673 LH A674 LY A675 LS A676, LA A676, LO A676, LY A676, LW A676 LS A679, LY A679, LG A679 - Hyper Micro SIDELED® LS Y876, LA Y876, LO Y876, LY Y876 LT Y87S - SmartLED LW L88C, LW L88S LB L89C, LB L89S, LG L890 LS L89K, LO L89K, LY L89K LS L896, LA L896, LO L896, LY L896 - TOPLED LS T670, LO T670, LY T670, LG T670, LP T670 LSG T670, LSP T670, LSY T670, LOP T670, LYG T670 LG T671, LOG T671, LSG T671 LB T673, LV T673, LT T673, LW T673 LH T674 LS T676, LA T676, LO T676, LY T676, LB T676, LH T676, LSB T676, LW T676 LB T67C, LV T67C, LT T67C, LS T67K, LO T67K, LY T67K, LW E67C LS E67B, LA E67B, LO E67B, LY E67B, LB E67C, LV E67C, LT E67C LW T67C LS T679, LY T679, LG T679 LS T770, LO T770, LY T770, LG T770, LP T770 LB T773, LV T773, LT T773, LW T773 LH T774 LS E675, LA E675, LY E675, LS T675 LS T776, LA T776, LO T776, LY T776, LB T776 LHGB T686 LT T68C, LB T68C - Hyper Mini TOPLED® LB M676 - Mini TOPLED Santana® LG M470 LS M47K, LO M47K, LY M47K Source: http://www.osram.convergy.de LUXEON: - LUMILED® LXK2-PW12-R00, LXK2-PW12-S00, LXK2-PW14-U00, LXK2-PW14-V00 LXK2-PM12-R00, LXK2-PM12-S00, LXK2-PM14-U00 LXK2-PE12-Q00, LXK2-PE12-R00, LXK2-PE12-S00, LXK2-PE14-T00, LXK2-PE14-U00 LXK2-PB12-K00, LXK2-PB12-L00, LXK2-PB12-M00, LXK2-PB14-N00, LXK2-PB14-P00, LXK2-PB14-Q00 LXK2-PR12-L00, LXK2-PR12-M00, LXK2-PR14-Q00, LXK2-PR14-R00 LXK2-PD12-Q00, LXK2-PD12-R00, LXK2-PD12-S00 LXK2-PH12-R00, LXK2-PH12-S00 LXK2-PL12-P00, LXK2-PL12-Q00, LXK2-PL12-R00 Source: www.luxeon.com KINGBRIGHT: KA-3528ASYC Source: www.kingbright.com
R1-R4 R7-R84 = rcl:R-EU_: RESISTOR, European symbol
R5 R6 = rcl:R-US_: RESISTOR, American symbol
S1-S4 = switch:255SB: SLIDING SWITCH Distributor Buerklin, 11G810
SV1 = con-ml:ML16: HARTING; OC_FARNELL: unknown; OC_NEWARK: unknown
TENSY3.2 = Teensy_3_and_LC_Series_Boards_v1.4:TEENSY_3.1-3.2_DIL: Teensy 3.1 or 3.2 in a DIL Layout.
TM1-TM16 = MANGU-Bourns 20PTA 20series:TRIM: Sliding potentiometers Based on Adafruits (https://github.com/adafruit/Adafruit-Eagle-Library) 'TRIM' device. For Bourns PTA series and TT Electronics PSxx series potentiometers.
U1 U2 U7 U8 = MusicThingModular:MCP6004: Generic Quad Op Amp
U3 U4 U6 U9 = Mangu:TL074: Generic Quad Op Amp
U5 = foxfield:74*4067: 16-channel analog MUX Datasheet <http://www.sparkfun.com/datasheets/IC/cd74hc4067.pdf> SparkFun Products MP3 Trigger <https://www.sparkfun.com/products/13720> (WIG-13720) SparkFun Analog/Digital MUX Breakout - CD74HC4067 <https://www.sparkfun.com/products/9056> (BOB-09056)
X1 = con-kycon:KUSBVX-BS1N: USB B-type Receptacle Vertical, 4 Position, Through Hole Source: Sibalco Kycon KUSBVX-BS1N-xxx.pdf